# Altium schematic sheet Control circuit.SchDoc (part 1 of 4)
size A4; SheetNumber: 3; SheetTotal: 8
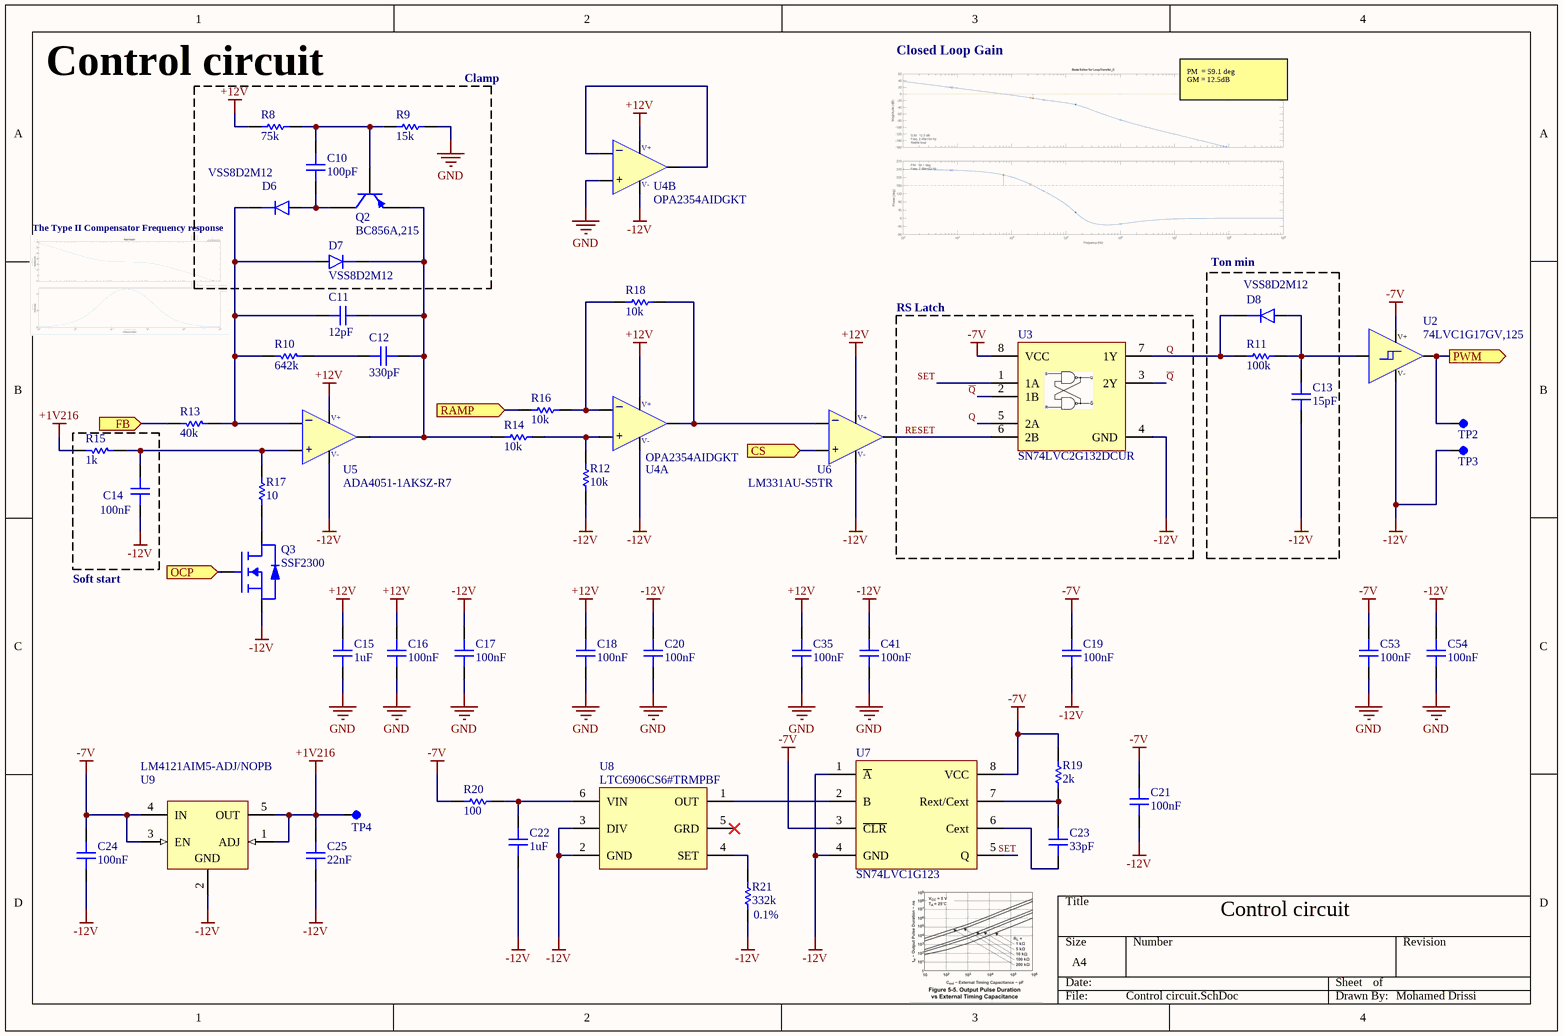
[diagram p0: Control circuit.SchDoc]

## Parts
C10  Capacitance: 100pF  [Cap_0603]  (hidden comment: GCM1885C2A101JA16D)
C11  Capacitance: 12pF  [cap_0603]  (hidden comment: VJ0603A120KXJCW1BC)
C12  Capacitance: 330pF  [Cap_0603]  (hidden comment: 885012006026)
C13  Capacitance: 15pF  [cap_0603]  (hidden comment: CL10C150JC81PNC)
C14  Capacitance: 100nF  [cap_0603]  (hidden comment: GMC10X7R104K100NT)
C15  Capacitance: 1uF  [cap_1206]  (hidden comment: 885382208005)
C16  Capacitance: 100nF  [cap_0603]  (hidden comment: GMC10X7R104K100NT)
C17  Capacitance: 100nF  [cap_0603]  (hidden comment: GMC10X7R104K100NT)
C18  Capacitance: 100nF  [cap_0603]  (hidden comment: GMC10X7R104K100NT)
C19  Capacitance: 100nF  [cap_0603]  (hidden comment: GMC10X7R104K100NT)
C20  Capacitance: 100nF  [cap_0603]  (hidden comment: GMC10X7R104K100NT)
C21  Capacitance: 100nF  [cap_0603]  (hidden comment: GMC10X7R104K100NT)
C22  Capacitance: 1uF  [cap_0603]  (hidden comment: CL10B105KA8NNNC)
C23  Capacitance: 33pF  [cap_0603]  (hidden comment: CL10C330JB8NNNC)
C24  Capacitance: 100nF  [cap_0603]  (hidden comment: GMC10X7R104K100NT)
C25  Capacitance: 22nF  [cap_0603]  (hidden comment: C0603C223K4RACTU)
C35  Capacitance: 100nF  [cap_0603]  (hidden comment: GMC10X7R104K100NT)
C41  Capacitance: 100nF  [cap_0603]  (hidden comment: GMC10X7R104K100NT)
C53  Capacitance: 100nF  [cap_0603]  (hidden comment: GMC10X7R104K100NT)
C54  Capacitance: 100nF  [cap_0603]  (hidden comment: GMC10X7R104K100NT)
D6  VSS8D2M12  [DO-221AD]
D7  VSS8D2M12  [DO-221AD]
D8  VSS8D2M12  [DO-221AD]
Q2  BC856A,215  [sot23]
Q3  SSF2300  [SOT-23-3]
R8  Resistance: 75k  [Res_0603]  (hidden comment: CRCW060375K0FKEAC)
R9  Resistance: 15k  [Res_0603]  (hidden comment: RC0603FR-0715KL)
R10  value 642k  [res_0603]  (hidden comment: RN73H1JTTD6423B50)
R11  Resistance: 100k  [res_0603]  (hidden comment: CRCW0603100KFKEA)
R12  Resistance: 10k  [res_0603]  (hidden comment: ERA-3AEB103V)
R13  value 40k  [Res_0603]  (hidden comment: AT0603BRD0740KL)
R14  Resistance: 10k  [res_0603]  (hidden comment: ERA-3AEB103V)
R15  Resistance: 1k  [res_0603]  (hidden comment: RC0603FR-071KL)
R16  Resistance: 10k  [res_0603]  (hidden comment: ERA-3AEB103V)
R17  Resistance: 10  [res_0603]  (hidden comment: RC0603FR-0710RL)
R18  Resistance: 10k  [res_0603]  (hidden comment: ERA-3AEB103V)
R19  Resisitance: 2k  [res_0603]  (hidden comment: RT0603BRD072KL)
R20  Resistance: 100  [res_0603]  (hidden comment: RC0603FR-07100RL)
R21  Tolerance: 0.1%  Resistance: 332k  [res_0603]  (hidden comment: RT0603BRD07332KL)
TP2  5000  [TH TP]  (value not drawn)
TP3  5000  [TH TP]  (value not drawn)
TP4  5000  [TH TP]  (value not drawn)
U2  74LVC1G17GV,125  [SOT353-1]
U3  SN74LVC2G132DCUR  [8-VSSOP]
U4  OPA2354AIDGKT  [TSOP, 8-Leads]  (parts A,B of 2)
U5  ADA4051-1AKSZ-R7  [5-Lead SOT-23]
U6  LM331AU-S5TR  [5-Lead SOT-23]
U7  SN74LVC1G123  [8-VSSOP]
U8  LTC6906CS6#TRMPBF  [sot23-6]
U9  LM4121AIM5-ADJ/NOPB  [5-Lead SOT-23]

## Blocks framed on the sheet
Clamp: C10 D6 D7 Q2 R8 R9
Ton min: C13 D8 R11
RS Latch: U3

## Ports
CS (in, see Main[3C], current sense[3B], Protections[4A]), FB (in, see Main[4C]), OCP (in, see Main[3C], Protections[4C]), PWM (out, see Main[3C], Power stage[4B]), RAMP (in, see Main[3C])

## Nets
+1V216: C25.2 R15.2 TP4.1 U9.1(ADJ) U9.5(OUT)
+12V: C15.1 C16.2 C18.2 C35.2 R8.1 U4.8(V+) U5.5(V+) U6.5(V+)
-7V: C19.2 C21.2 C24.2 C53.2 R19.2 R20.1 U2.5(V+) U3.8(VCC) U7.3(~{CLR}) U7.8(VCC) U9.3(EN) U9.4(IN)
-12V: C13.1 C14.1 C17.2 C19.1 C20.2 C21.1 C22.1 C24.1 C25.1 C41.2 C54.2 Q3.1(S) R12.2 R21.1 TP3.1 U2.3(V-) U3.4(GND) U4.4(V-) U5.2(V-) U6.2(V-) U7.1(~{A}) U7.4(GND) U8.2(GND) U8.3(DIV) U9.2(GND)
GND: C15.2 C16.1 C17.1 C18.1 C20.1 C35.1 C41.1 C53.1 C54.1 R9.2 U4.5(IN-)
CS: U6.1(IN-) ; port CS
FB: R13.2 ; port FB
OCP: Q3.2(G) ; port OCP
PWM: TP2.1 U2.4(Y) ; port PWM
Q: D8.C R11.1 U3.5(2A) U3.7(1Y)
~{Q}: U3.2(1B) U3.3(2Y)
RAMP: R16.1 ; port RAMP
RESET: U3.6(2B) U6.4(OUT)
SET: U3.1(1A) U7.5(Q)
NetC10_1: C10.1 D6.A Q2.3(C)
NetC10_2: C10.2 Q2.1(B) R8.2 R9.1
NetC11_1: C11.1 C12.1 D7.C Q2.2(E) R14.1 U5.4(OUT)
NetC11_2: C11.2 D6.C D7.A R10.2 R13.1 U5.3(IN+)
NetC12_2: C12.2 R10.1
NetC13_2: C13.2 D8.A R11.2 U2.2(A)
NetC14_2: C14.2 R15.1 R17.2 U5.1(IN-)
NetC22_2: C22.2 R20.2 U8.6(VIN)
NetC23_1: C23.1 U7.6(Cext)
NetC23_2: C23.2 R19.1 U7.7(Rext/Cext)
NetQ3_3: Q3.3(D) R17.1
NetR12_1: R12.1 R14.2 U4.3(IN-)
NetR16_2: R16.2 R18.1 U4.2(IN+)
NetR18_2: R18.2 U4.1(OUT) U6.3(IN+)
NetR21_2: R21.2 U8.4(SET)
NetU4_6: U4.6(IN+) U4.7(OUT)
NetU7_2: U7.2(B) U8.1(OUT)

Not connected (* = marked no-connect by the designer): U8 5(GRD)*

## Notes on the sheet
- Control circuit
- Closed Loop Gain
- PM  = 59.1 deg
  GM = 12.5dB
- (near D6) The Type II Compensator Frequency response
- Soft start
- Mohamed Drissi
- (in symbol 3Peak LM331AU-S5TR) _; +
- (in symbol Analog Device ADA4051-1AKSZ-R7) _; +
- (in symbol TI OPA2354AIDGKT, part A) _; +
- (in symbol TI OPA2354AIDGKT, part B) _; +